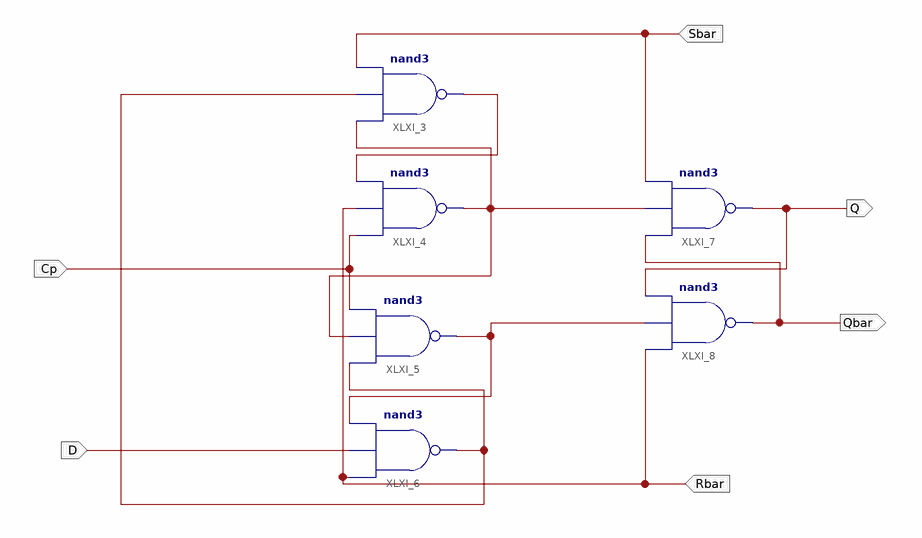
[diagram p0: schematic sheet 1]
// Xilinx ISE schematic D_FLIPFLOP.sch (artix7) as structural Verilog: 6 symbols, 6 ports
module D_FLIPFLOP (
  input  Cp,
  input  Sbar,
  input  D,
  input  Rbar,
  output Q,
  output Qbar
);

  wire XLXN_1, XLXN_2, XLXN_9, XLXN_13;

  nand XLXI_3 (XLXN_1, XLXN_2, XLXN_13, Sbar);
  nand XLXI_4 (XLXN_2, Cp, Rbar, XLXN_1);
  nand XLXI_5 (XLXN_9, XLXN_13, XLXN_2, Cp);
  nand XLXI_6 (XLXN_13, Rbar, D, XLXN_9);
  nand XLXI_7 (Q, Qbar, XLXN_2, Sbar);
  nand XLXI_8 (Qbar, Rbar, XLXN_9, Q);
endmodule
